# EAGLE schematic MainBoad (EAGLE 8.5.2)
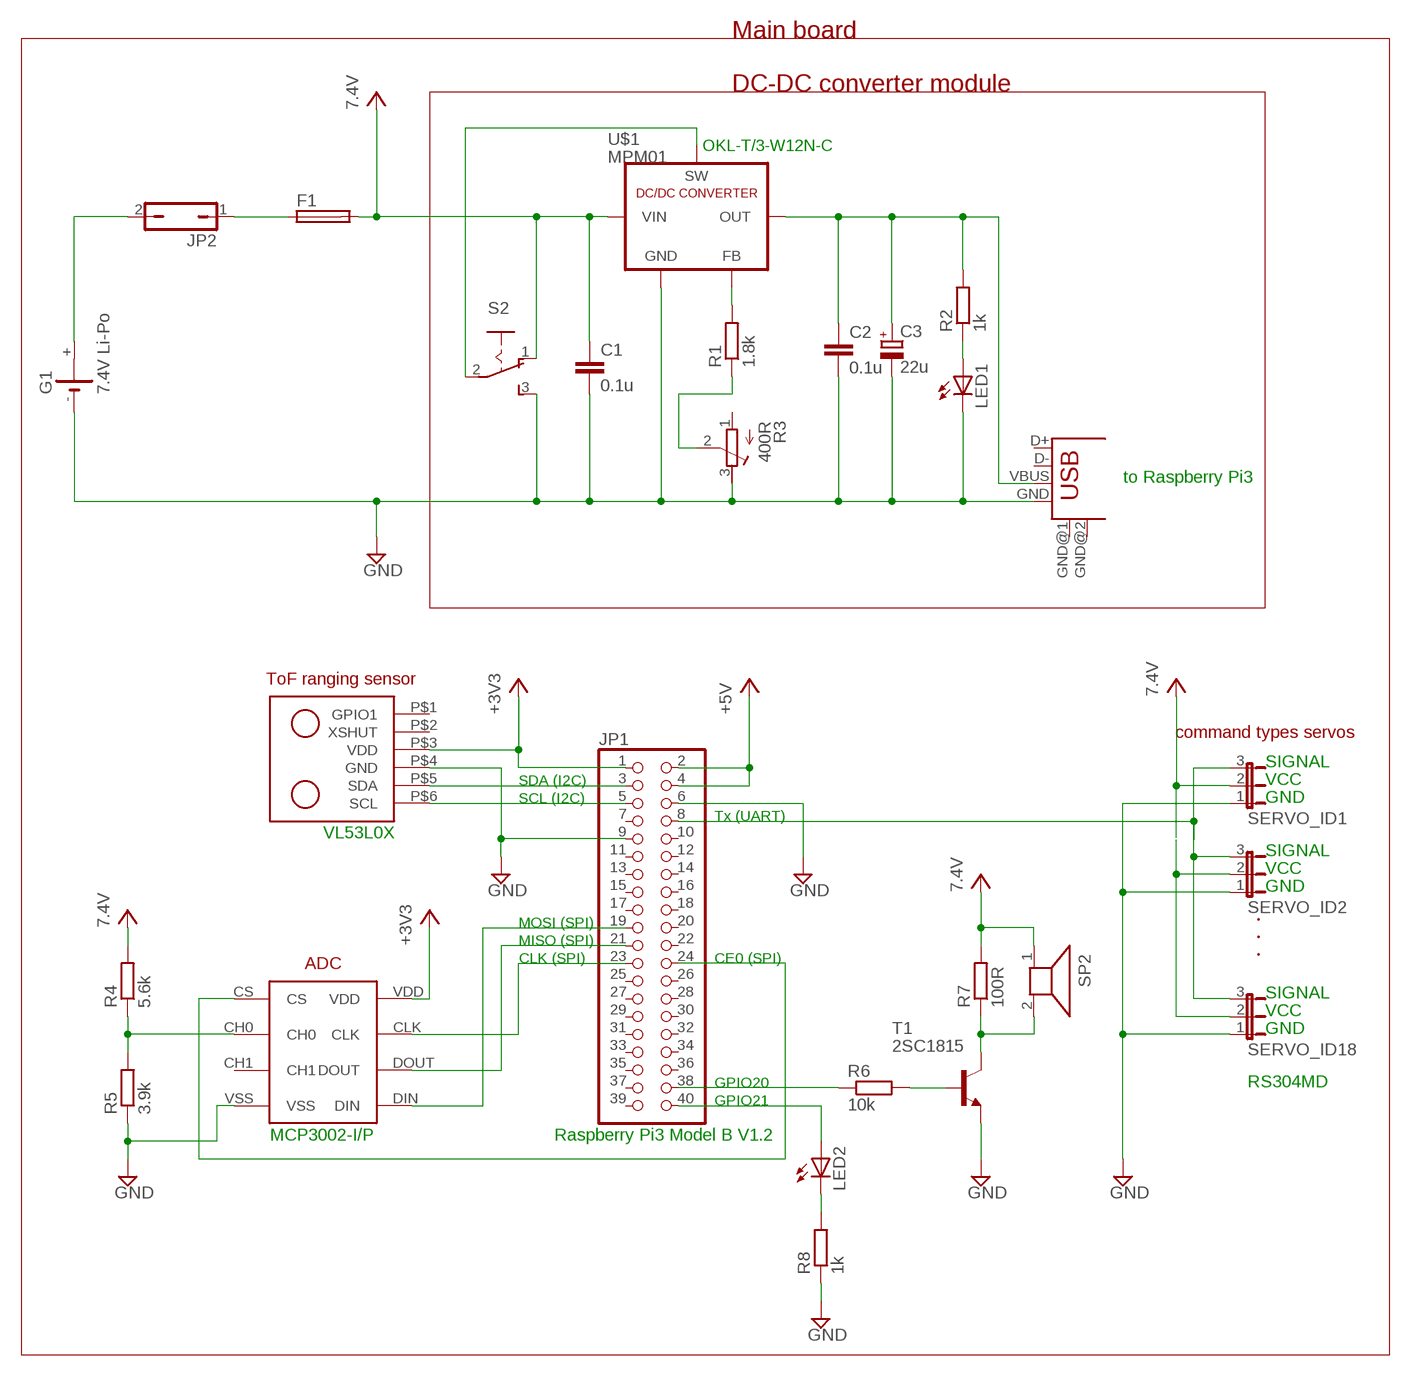
[diagram p0: schematic, sheet 1]

## Parts
C1  0.1u  C-EU025-024X044  [C025-024X044]
C2  0.1u  C-EU025-024X044  [C025-024X044]
C3  22u  CPOL-EU085CS-1AR  [085CS_1AR]
F1  19559  [19559]
G1  7.4V Li-Po  1V60R  [1V60R]
JP1  PINHD-2X20  [2X20]
JP2  JP1Q  [JP1]
LED1  LED3MM  [LED3MM]
LED2  LED3MM  [LED3MM]
R1  1.8k  R-EU_0204/7  [0204/7]
R2  1k  R-EU_0204/7  [0204/7]
R3  400R  R-TRIMM3304W  [RTRIM3304W]
R4  5.6k  R-EU_0204/7  [0204/7]
R5  3.9k  R-EU_0204/7  [0204/7]
R6  10k  R-EU_0207/7  [0207/7]
R7  100R  R-EU_0207/7  [0207/7]
R8  1k  R-EU_0207/7  [0207/7]
S2  255SB  [255SB]
SERVO_ID1  JP2E  [JP2]
SERVO_ID2  JP2E  [JP2]
SERVO_ID18  JP2E  [JP2]
SP2  AL201P  [AL201P]
T1  2SC1815  [TO92-ECB]
U$1  MPM01  [MPM01]
U$2  VL53L0X  [VL53L0X]
U$3  MCP3002  [MCP3002]
USB1  USB-A-H  [USB-A-H]

## Nets
+3V3: JP1.1 U$2.P$3(VDD) U$3.VDD
+5V: JP1.2 JP1.4
GND: C1.2 C2.2 C3.- G1.- JP1.6 JP1.9 LED1.K(C) R3.3(E) R5.1 R8.1 S2.3(S) SERVO_ID1.1 SERVO_ID2.1 SERVO_ID18.1 T1.E U$1.P$1(GND) U$1.P$3(GND) U$2.P$4(GND) U$3.VSS USB1.GND
N$1: C2.1 C3.+ R2.2 U$1.P$5(OUT) U$1.P$6(OUT) U$1.P$7(OUT) USB1.VBUS
N$2: G1.+ JP2.2
N$3: JP1.8 SERVO_ID2.3 SERVO_ID18.3
N$4: SERVO_ID1.3
N$5: F1.1 JP2.1
N$6: R1.2 U$1.P$4(FB)
N$7: SERVO_ID2.2 SERVO_ID18.2
N$8: R1.1 R3.2(S)
N$9: JP1.5 U$2.P$6(SCL)
N$10: S2.2(P) U$1.P$8(SW) U$1.P$9(SW)
N$11: LED1.A R2.1
N$12: JP1.3 U$2.P$5(SDA)
N$13: JP1.24 U$3.CS
N$14: JP1.21 U$3.DOUT
N$16: JP1.40 LED2.A
N$17: R4.1 R5.2 U$3.CH0
N$18: JP1.23 U$3.CLK
N$19: R6.2 T1.B
N$20: JP1.19 U$3.DIN
N$21: JP1.38 R6.1
N$22: R7.1 SP2.2 T1.C
N$23: LED2.K(C) R8.2
VCC: C1.1 F1.2 R4.2 R7.2 S2.1(O) SERVO_ID1.2 SP2.1 U$1.P$2(VIN) ; supply symbol labelled 7.4V
Unconnected: G1.+@1(+) JP1.7 JP1.10 JP1.11 JP1.12 JP1.13 JP1.14 JP1.15 JP1.16 JP1.17 JP1.18 JP1.20 JP1.22 JP1.25 JP1.26 JP1.27 JP1.28 JP1.29 JP1.30 JP1.31 JP1.32 JP1.33 JP1.34 JP1.35 JP1.36 JP1.37 JP1.39 R3.1(A) U$2.P$1(GPIO1) U$2.P$2(XSHUT) U$3.CH1 USB1.D+ USB1.D- USB1.GND@1(GND) USB1.GND@2(GND)

## Notes on the sheet
- Main board
- DC-DC converter module
- OKL-T/3-W12N-C
- to Raspberry Pi3
- ToF ranging sensor
- command types servos
- SIGNAL
- SDA (I2C) | VCC
- SCL (I2C) | GND
- Tx (UART)
- VL53L0X
- SIGNAL
- VCC
- GND
- MOSI (SPI)
- MISO (SPI)
- ADC | CLK (SPI) | CE0 (SPI) | ・・・
- SIGNAL
- VCC
- GND
- GPIO20 | RS304MD
- GPIO21
- MCP3002-I/P | Raspberry Pi3 Model B V1.2

## Library data of the parts
C1 C2 = rcl:C-EU: CAPACITOR, European symbol
C3 = resistor:CPOL-EU: POLARIZED CAPACITOR, European symbol
F1 = fuse:19559: FUSE HOLDER TR5, Wickmann; MPN: 55900000001; OC_FARNELL: 9516360; OC_NEWARK: 02P0286
G1 = battery:1V60R: NC ACCU Varta
JP1 = adafruit:PINHD-2X20: PIN HEADER
JP2 = jumper:JP1Q: JUMPER
LED1 LED2 = led:LED: LED OSRAM: - CHIPLED LG R971, LG N971, LY N971, LG Q971, LY Q971, LO R971, LY R971 LH N974, LH R974 LS Q976, LO Q976, LY Q976 LO Q996 - Hyper CHIPLED LW Q18S LB Q993, LB Q99A, LB R99A - SideLED LS A670, LO A670, LY A670, LG A670, LP A670 LB A673, LV A673, LT A673, LW A673 LH A674 LY A675 LS A676, LA A676, LO A676, LY A676, LW A676 LS A679, LY A679, LG A679 - Hyper Micro SIDELED® LS Y876, LA Y876, LO Y876, LY Y876 LT Y87S - SmartLED LW L88C, LW L88S LB L89C, LB L89S, LG L890 LS L89K, LO L89K, LY L89K LS L896, LA L896, LO L896, LY L896 - TOPLED LS T670, LO T670, LY T670, LG T670, LP T670 LSG T670, LSP T670, LSY T670, LOP T670, LYG T670 LG T671, LOG T671, LSG T671 LB T673, LV T673, LT T673, LW T673 LH T674 LS T676, LA T676, LO T676, LY T676, LB T676, LH T676, LSB T676, LW T676 LB T67C, LV T67C, LT T67C, LS T67K, LO T67K, LY T67K, LW E67C LS E67B, LA E67B, LO E67B, LY E67B, LB E67C, LV E67C, LT E67C LW T67C LS T679, LY T679, LG T679 LS T770, LO T770, LY T770, LG T770, LP T770 LB T773, LV T773, LT T773, LW T773 LH T774 LS E675, LA E675, LY E675, LS T675 LS T776, LA T776, LO T776, LY T776, LB T776 LHGB T686 LT T68C, LB T68C - Hyper Mini TOPLED® LB M676 - Mini TOPLED Santana® LG M470 LS M47K, LO M47K, LY M47K Source: http://www.osram.convergy.de LUXEON: - LUMILED® LXK2-PW12-R00, LXK2-PW12-S00, LXK2-PW14-U00, LXK2-PW14-V00 LXK2-PM12-R00, LXK2-PM12-S00, LXK2-PM14-U00 LXK2-PE12-Q00, LXK2-PE12-R00, LXK2-PE12-S00, LXK2-PE14-T00, LXK2-PE14-U00 LXK2-PB12-K00, LXK2-PB12-L00, LXK2-PB12-M00, LXK2-PB14-N00, LXK2-PB14-P00, LXK2-PB14-Q00 LXK2-PR12-L00, LXK2-PR12-M00, LXK2-PR14-Q00, LXK2-PR14-R00 LXK2-PD12-Q00, LXK2-PD12-R00, LXK2-PD12-S00 LXK2-PH12-R00, LXK2-PH12-S00 LXK2-PL12-P00, LXK2-PL12-Q00, LXK2-PL12-R00 Source: www.luxeon.com KINGBRIGHT: KA-3528ASYC Source: www.kingbright.com
R1 R2 R4-R8 = resistor:R-EU_: RESISTOR, European symbol
R3 = resistor:R-TRIMM: Trimm resistor
S2 = switch:255SB: SLIDING SWITCH Distributor Buerklin, 11G810
SERVO_ID1 SERVO_ID2 SERVO_ID18 = jumper:JP2E: JUMPER
SP2 = buzzer:AL201P: SPEAKER Source: Buerklin; OC_FARNELL: unknown; OC_NEWARK: unknown
T1 = transistor:2SC1815: NPN EPITAXIAL TRANSISTOR Source: TOSHIBA .. 2SC1815 1.pdf
U$1 = dc-dc-converter:MPM01
U$2 = getter-sensor:VL53L0X
U$3 = getter-sensor:MCP3002
USB1 = con-usb-2:USB: USB Connectors